# Altium schematic sheet can.SchDoc: CAN/CANOpen Interface
size A4; SheetNumber: 13; SheetTotal: 17
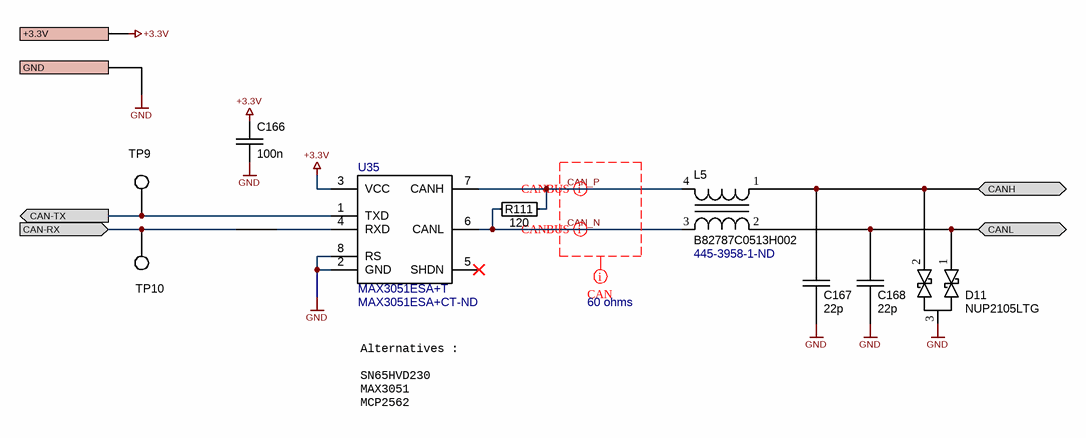
[diagram p0: can.SchDoc]

## Parts
C166  value 100n  [SM/C0402]  (hidden comment: CL05A104KP5NNNC)
C167  22p  [SM/C0402]
C168  22p  [SM/C0402]
D11  NUP2105LTG  [SOT23-3]
L5  B82787C0513H002  Supplier Part Number 1: 445-3958-1-ND  [ACT45B]
R111  120  [SM/R0402]
TP9  RCUCTE  [TP/RCUCT]  (value not drawn)
TP10  RCUCTE  [TP/RCUCT]  (value not drawn)
U35  MAX3051ESA+T  Supplier Part Number 1: MAX3051ESA+CT-ND  [SOIC8]

## Ports
+3.3V, CAN-RX (in), CAN-TX (out), CANH (bidir), CANL (bidir), GND

## Nets
+3.3V: C166.1 U35.3(VCC) ; port +3.3V
GND: C166.2 C167.2 C168.2 D11.3 U35.2(GND) U35.8(RS) ; port GND
CAN-RX: TP10.1 U35.4(RXD) ; port CAN-RX
CAN-TX: TP9.1 U35.1(TXD) ; port CAN-TX
CAN_N: L5.3 R111.1 U35.6(CANL)
CAN_P: L5.4 R111.2 U35.7(CANH)
CANH: C167.1 D11.2 L5.1 ; port CANH
CANL: C168.1 D11.1 L5.2 ; port CANL

Not connected (* = marked no-connect by the designer): U35 5(SHDN)*

## Layout directives
differential pair: CAN_N, CAN_P
rule Impedance Constraint [Min = 50.00    Max = 70.00    ]; Impedance: 60 ohms: CAN_N, CAN_P

## Notes on the sheet
- Alternatives :
  SN65HVD230
  MAX3051
  MCP2562
- HES-SO / HEIG-VD / TIN / IAI
  Route de Cheseaux, 1
  CH-1401 Yverdon-les-Bains
  +41 24 557 73 77
  http://iai.heig-vd.ch
  iai@heig-vd.ch
- Title
- Format
- Date
- A4
- Project Name
- Author
- Project ID
- VCS
- Revision
- Page
- /
- File

## Library data of the parts
C166 = C: Chip Capacitor; Voltage: 16V; Dielectric: X7R; Supplier 1: Digi-Key; Supplier Part Number 1: 1276-1022-1-ND
C167 C168 = C: 22 pF ±2% 50V Ceramic Capacitor C0G, NP0 0402 (1005 Metric); Dielectric: NPO; Supplier 1: Digi-Key; Supplier Part Number 1: 311-1652-1-ND; Value: 22p; Voltage: 50V
L5 = L_B82787C0513H002: CMC 51UH 200MA 2LN SMD AEC-Q200; Supplier 1: Digi-Key
R111 = R: Chip Resistor SMD; Supplier 1: Digi-Key; Supplier Part Number 1: 311-120LRCT-ND; Value: 120
TP9 TP10 = TP: PC Test Point Plating Surface Mount Mounting Type; Supplier 1: Digi-Key; Supplier Part Number 1: 2019-RCUCTECT-ND
U35 = MAX3051: 1/1 Transceiver Half CANbus 8-SOIC; Supplier 1: Digi-Key
D11 = NUP2105LTG: Supplier 1: Digi-Key; Supplier Part Number 1: NUP2105LT1GOSCT-ND